# Altium schematic sheet Carte1.SchDoc
size A4
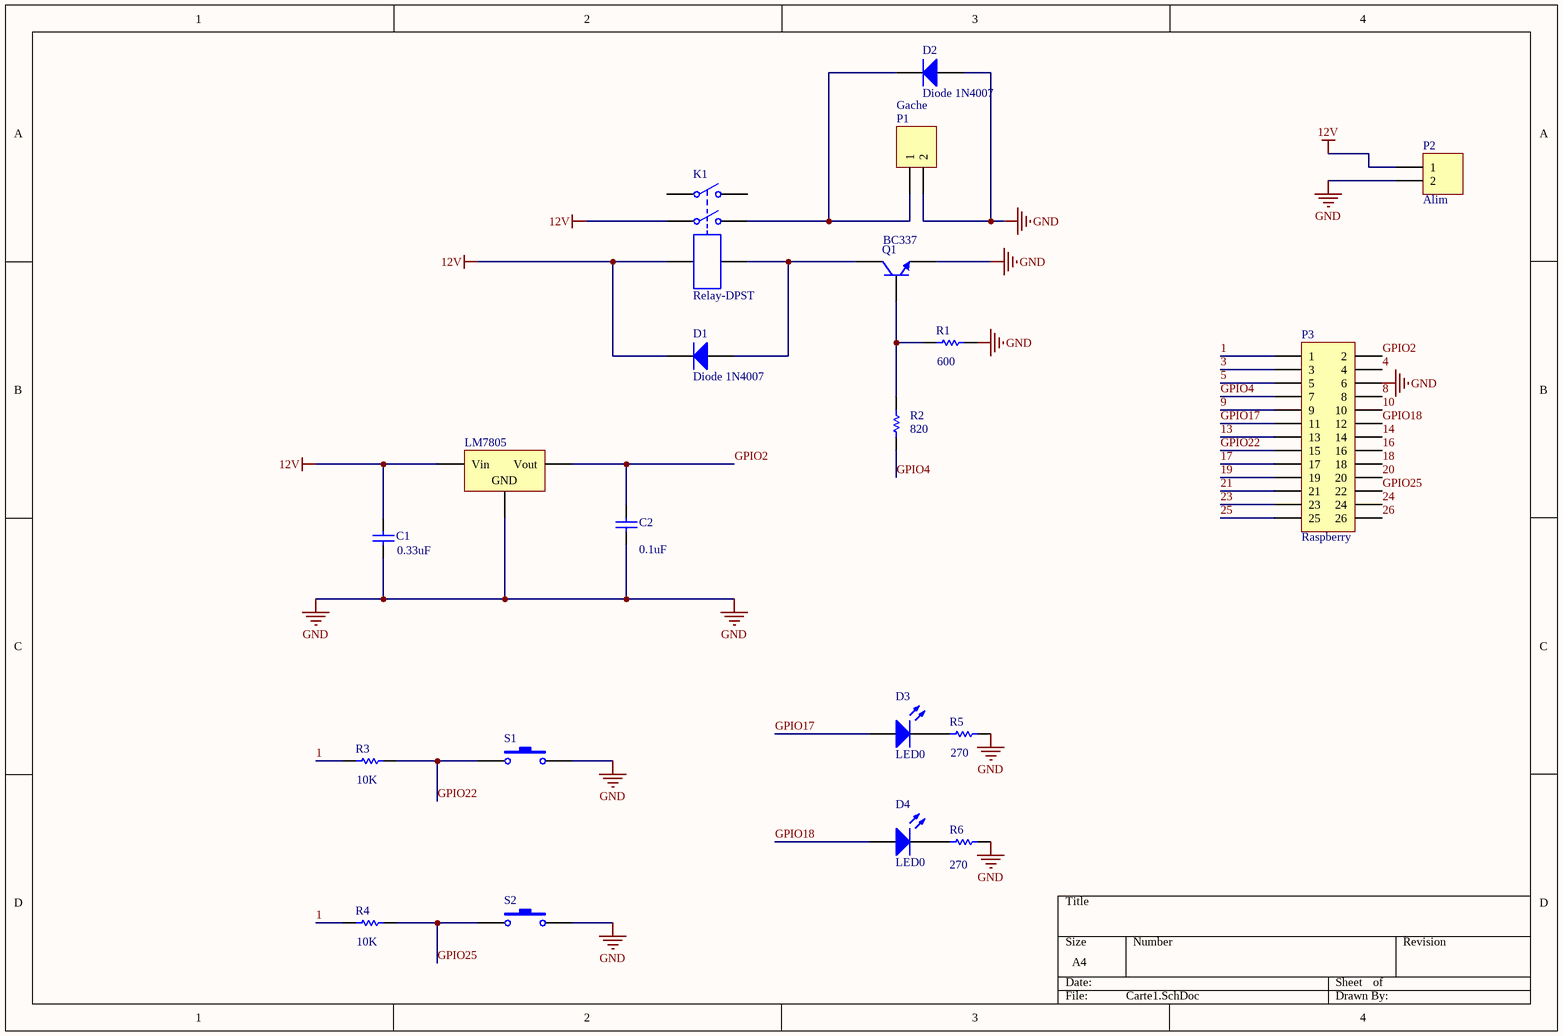
[diagram p0: Carte1.SchDoc]

## Parts
C1  value 0.33uF  [RAD-0.2]
C2  value 0.1uF  [RAD-0.2]
D1  Diode 1N4007  [DIODE-0.4]
D2  Diode 1N4007  [DIODE-0.4]
D3  LED0  [LED]
D4  LED0  [LED]
K1  Relay-DPST  [Relais1]
LM7805  (no value)  [TO220V]
P1  Gache  [BORN5-2]
P2  Alim  [BORN5-2]
P3  Raspberry  [DIP-20]
Q1  BC337  [TO92-2]
R1  value 600  [AXIAL-0.5]
R2  value 820  [AXIAL-0.5]
R3  value 10K  [AXIAL-0.5]
R4  value 10K  [AXIAL-0.5]
R5  value 270  [AXIAL-0.5]
R6  value 270  [AXIAL-0.5]
S1  (no value)  [BP]
S2  (no value)  [BP]

## Nets
12V: C1.2 D1.2(K) K1.3 K1.5 LM7805.1(Vin) P2.1
GND: C1.1 C2.1 D2.1(A) LM7805.2(GND) P1.2 P2.2 P3.6 Q1.1(E) R1.2 R5.2 R6.2 S1.2 S2.2
1: P3.1 R3.1 R4.1
3: P3.3
4: P3.4
5: P3.5
8: P3.8
9: P3.9
10: P3.10
13: P3.13
14: P3.14
16: P3.16
17: P3.17
18: P3.18
19: P3.19
20: P3.20
21: P3.21
23: P3.23
24: P3.24
25: P3.25
26: P3.26
GPIO2: C2.2 LM7805.3(Vout) P3.2
GPIO4: P3.7 R2.1
GPIO17: D3.1(A) P3.11
GPIO18: D4.1(A) P3.12
GPIO22: P3.15 R3.2 S1.1
GPIO25: P3.22 R4.2 S2.1
NetD1_1: D1.1(A) K1.6 Q1.3(C)
NetD2_2: D2.2(K) K1.4 P1.1
NetD3_2: D3.2(K) R5.1
NetD4_2: D4.2(K) R6.1
NetQ1_2: Q1.2(B) R1.1 R2.2

Not connected (* = marked no-connect by the designer): K1 1 2

## Library data of the parts
C1 C2 = Cap: Capacitor; Published: 8-Jun-2000; LatestRevisionDate: 17-Jul-2002; LatestRevisionNote: Re-released for DXP Platform.; PackageReference: RAD-0.3; Publisher: Altium Limited; PackageDescription: Radial Cap, Thru-Hole; 2 Leads; 0.3 in Pin Spacing
D1 D2 = Diode 1N4007: 1 Amp General Purpose Rectifier; Published: 8-Jun-2000; LatestRevisionDate: 17-Jul-2002; LatestRevisionNote: Re-released for DXP Platform.; DatasheetVersion: 1998; PackageVersion: Aug-1999; PackageReference: DO-41; Publisher: Altium Limited; PackageDescription: Diode, Axial; Body 5.2 x 2.7 mm (LxDia. max), Lead Dia. 0.86 mm (max); Code_JEDEC: DO-204-AL; ComponentLink1Description: Manufacturer Link; ComponentLink1URL: http://www.fairchildsemi.com/; ComponentLink2Description: Datasheet; ComponentLink2URL: http://www.fairchildsemi.com/ds/1N%2F1N4001.pdf
D3 D4 = LED0: Typical INFRARED GaAs LED; Published: 8-Jun-2000; LatestRevisionDate: 08-Jul-2005; LatestRevisionNote: Mech Layer 1 removed.; PackageReference: LED-0; Publisher: Altium Limited; PackageDescription: LED; 2 Leads
K1 = Relay-DPST: Dual-Pole Single-Throw Relay; Published: 24-Mar-1999; LatestRevisionDate: 17-Jul-2002; LatestRevisionNote: Re-released for DXP Platform.; PackageReference: MODULE6; Publisher: Altium Limited
LM7805 = Volt Reg: Voltage Regulator; Published: 24-Mar-1999; LatestRevisionDate: 29-May-2009; LatestRevisionNote: IPC-7351 Footprint Added.; PackageReference: D2PAK; Publisher: Altium Limited; PackageDescription: 3-Pin Transistor Outline Package 2.54 mm Pitch, 15.1 mm Lead Span
P1 P2 = Header 2: Header, 2-Pin; LatestRevisionDate: 17-Jul-2002; LatestRevisionNote: Re-released for DXP Platform.; Publisher: Altium Limited
P3 = MHDR2X13: Header, 13-Pin, Dual row; LatestRevisionDate: 17-Jul-2002; LatestRevisionNote: Re-released for DXP Platform.; Publisher: Altium Limited
Q1 = 2N3904: NPN General Purpose Amplifier; Published: 8-Jun-2000; LatestRevisionDate: 15-Jan-2003; LatestRevisionNote: PCB Footprint 'BCY-W3/D4.7' replaced; DatasheetVersion: 1997; PackageVersion: Sep-1998; PackageReference: TO-92A; Publisher: Altium Limited; PackageDescription: TO, Flat Index; 3 In-Line, Axial Leads; Body Dia. 4.5mm; Leads 0.51 x 0.48 mm (max); ComponentLink1Description: Manufacturer Link; ComponentLink1URL: http://www.fairchildsemi.com/; ComponentLink2Description: Datasheet; ComponentLink2URL: http://www.fairchildsemi.com/ds/2N%2F2N3904.pdf
R1-R6 = Res1: Resistor; Published: 8-Jun-2000; LatestRevisionDate: 17-Jul-2002; LatestRevisionNote: Re-released for DXP Platform.; PackageReference: AXIAL-0.3; Publisher: Altium Limited; PackageDescription: Axial Device, Thru-Hole; 2 Leads; 0.3 in Pin Spacing
S1 S2 = SW-PB: Switch; Published: 24-Mar-1999; LatestRevisionDate: 17-Jul-2002; LatestRevisionNote: Re-released for DXP Platform.; PackageReference: SPST-2; Publisher: Altium Limited; PackageDescription: Switch; 2 Leads